# EAGLE design QuadPortIEC_v2 (EAGLE 7.7.0)
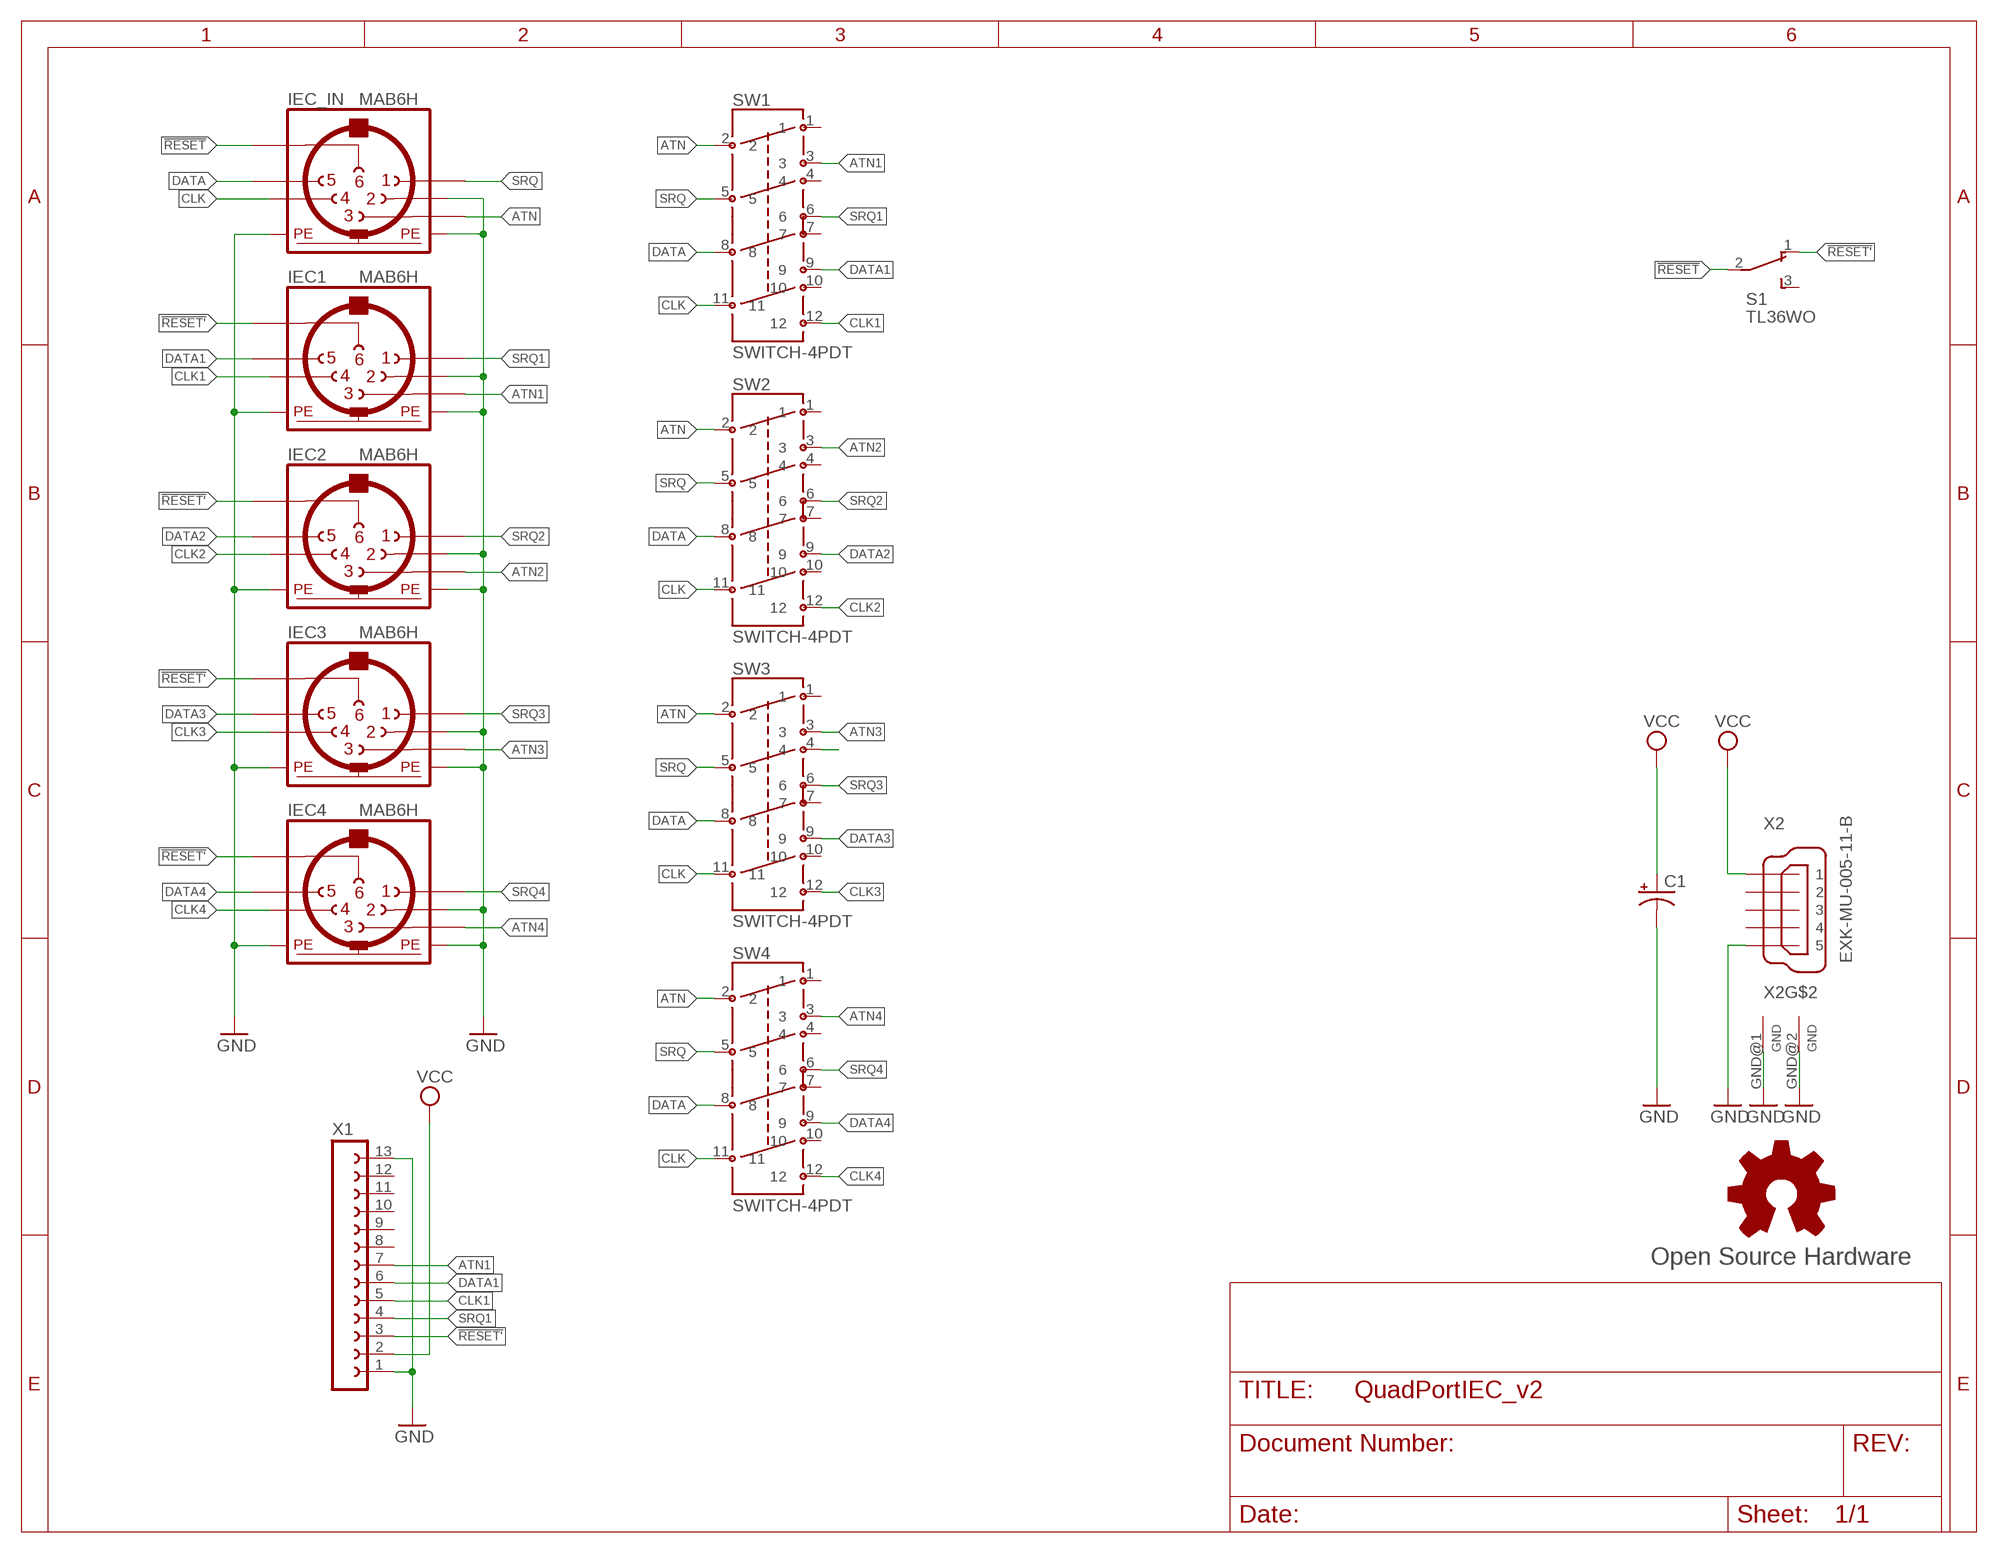
[diagram p0: schematic, sheet 1]

## Parts
C1  CPOL-USE5-8.5  [E5-8,5]
GOLD_ORB_SM1  Open Source Hardware  OSHWLOGOLOGO8MM  [OSHW_8MM]
IEC1  MAB6H  [MAB6H]
IEC2  MAB6H  [MAB6H]
IEC3  MAB6H  [MAB6H]
IEC4  MAB6H  [MAB6H]
IEC_IN  MAB6H  [MAB6H]
S1  TL36WO  [TL3XWO]
SW1  SWITCH-4PDT  [SWITCH-4PDT-ALPS]
SW2  SWITCH-4PDT  [SWITCH-4PDT-ALPS]
SW3  SWITCH-4PDT  [SWITCH-4PDT-ALPS]
SW4  SWITCH-4PDT  [SWITCH-4PDT-ALPS]
X1  FE13W  [FE13W]
X2  EXK-MU-005-11-B  [MINI-USB]

## Nets
!RESET: IEC_IN.6 S1.2(P)
!RESET': IEC1.6 IEC2.6 IEC3.6 IEC4.6 S1.1(O) X1.3
ATN: IEC_IN.3 SW1.2 SW2.2 SW3.2 SW4.2
ATN1: IEC1.3 SW1.3 X1.7
ATN2: IEC2.3 SW2.3
ATN3: IEC3.3 SW3.3
ATN4: IEC4.3 SW4.3
CLK: IEC_IN.4 SW1.11 SW2.11 SW3.11 SW4.11
CLK1: IEC1.4 SW1.12 X1.5
CLK2: IEC2.4 SW2.12
CLK3: IEC3.4 SW3.12
CLK4: IEC4.4 SW4.12
DATA: IEC_IN.5 SW1.8 SW2.8 SW3.8 SW4.8
DATA1: IEC1.5 SW1.9 X1.6
DATA2: IEC2.5 SW2.9
DATA3: IEC3.5 SW3.9
DATA4: IEC4.5 SW4.9
GND: C1.- IEC1.2 IEC1.PE IEC1.PE@(PE) IEC2.2 IEC2.PE IEC2.PE@(PE) IEC3.2 IEC3.PE IEC3.PE@(PE) IEC4.2 IEC4.PE IEC4.PE@(PE) IEC_IN.2 IEC_IN.PE IEC_IN.PE@(PE) X1.1 X1.13 X2.GND X2.GND@1(GND) X2.GND@2(GND)
N$32: SW3.4
SRQ: IEC_IN.1 SW1.5 SW2.5 SW3.5 SW4.5
SRQ1: IEC1.1 SW1.6 X1.4
SRQ2: IEC2.1 SW2.6
SRQ3: IEC3.1 SW3.6
SRQ4: IEC4.1 SW4.6
VCC: C1.+ X1.2 X2.VBUS
Unconnected: S1.3(S) SW1.1 SW1.4 SW1.7 SW1.10 SW2.1 SW2.4 SW2.7 SW2.10 SW3.1 SW3.7 SW3.10 SW4.1 SW4.4 SW4.7 SW4.10 X1.8 X1.9 X1.10 X1.11 X1.12 X2.D+ X2.D- X2.ID

## Library data of the parts
C1 = rcl:CPOL-US: POLARIZED CAPACITOR, American symbol
GOLD_ORB_SM1 = oshw:OSHWLOGO: The OSHW logo for PCB layout
IEC1-IEC4 IEC_IN = con-hirschmann:MAB6H: Female CONNECTOR 6 pins with shield, horizontal (DIN 45322)
S1 = switch:TL36WO: TINY SWITCH ON - ON Source: http://www2.produktinfo.conrad.com/datenblaetter/700000-724999/705152-da-01-de-Subminiaturschalter_TL_36WO.pdf
SW1-SW4 = switch-alps-jlb:SWITCH-4PDT: For use with a push-button switch made by ALPS components. The Part # is
X1 = con-lsta-rp:FE13W: FEMALE HEADER; OC_FARNELL: unknown; OC_NEWARK: unknown
X2 = con-usb-jlb:EXK-MU-005-11-B

## Board
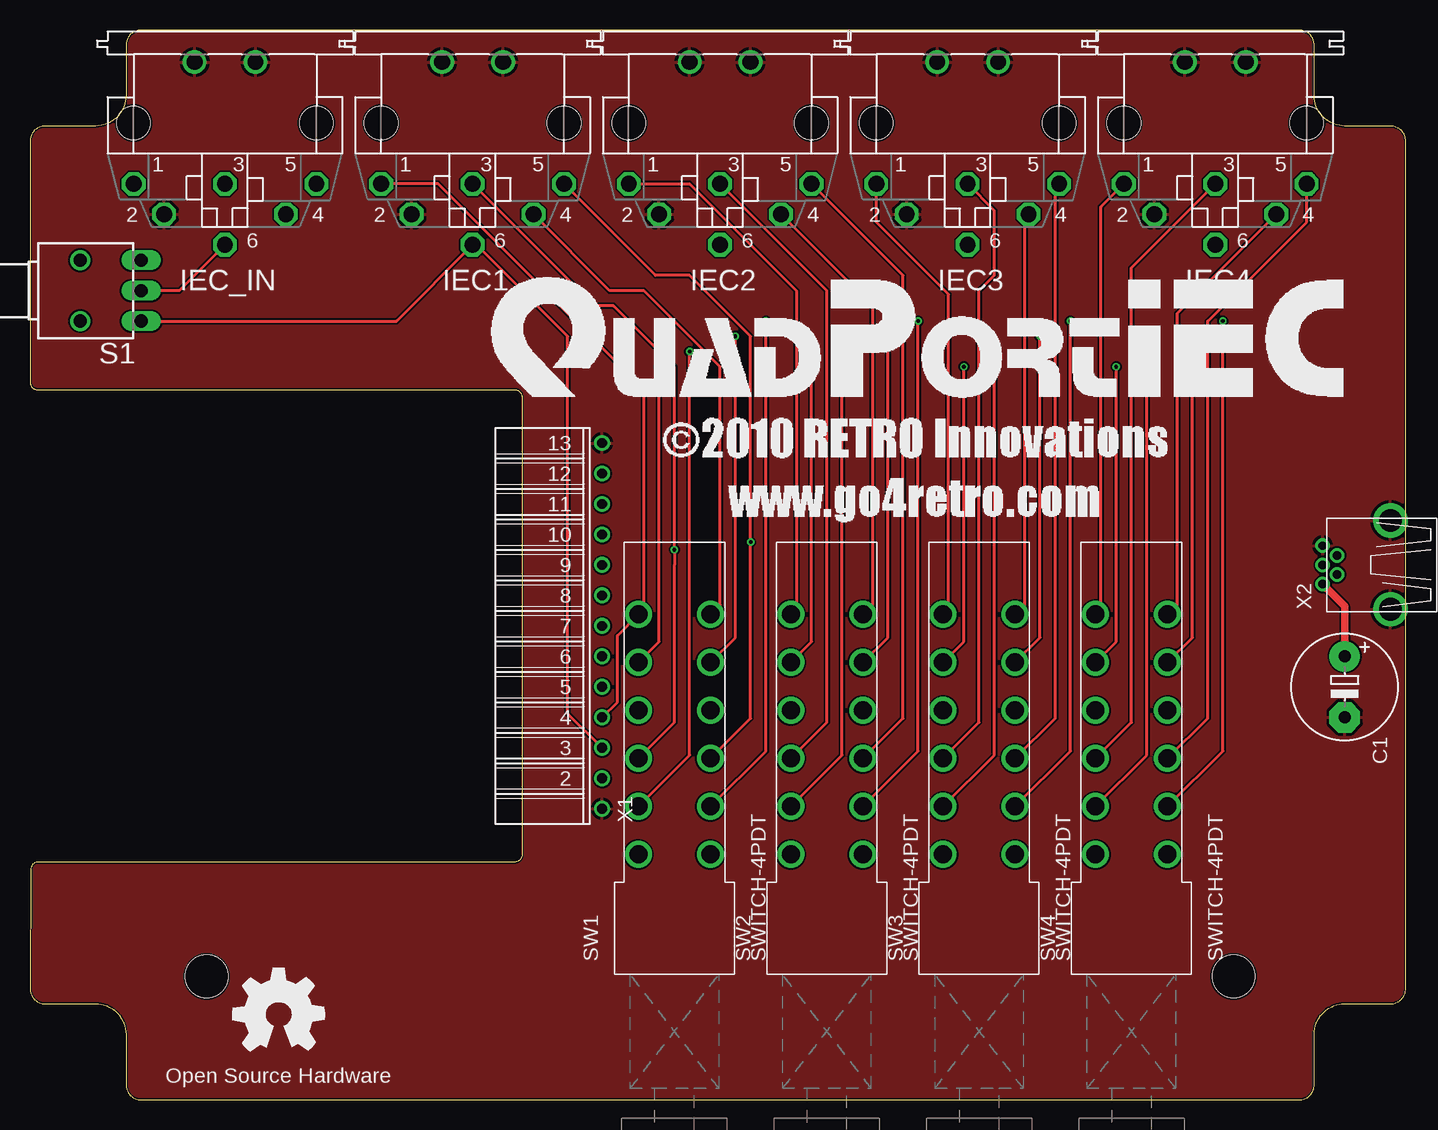
[diagram p1: board, top side]
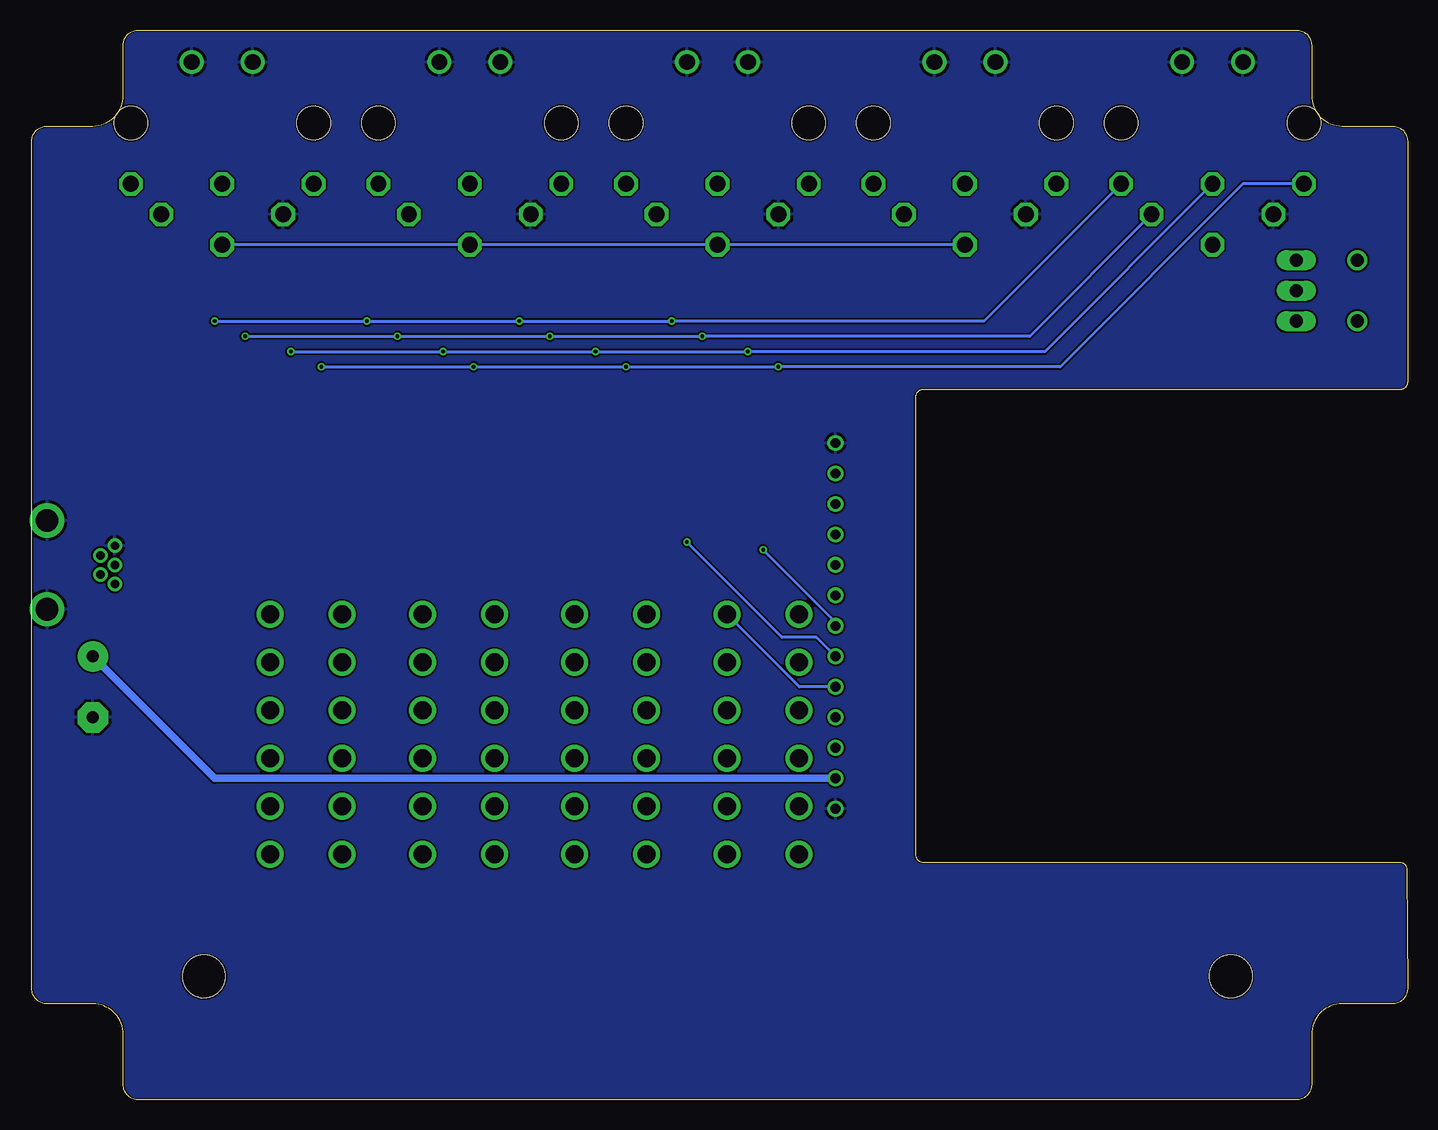
[diagram p2: board, bottom side, seen from below]

Size 114.68 x 89.15 mm. Coordinates in mm from the lower left corner, seen from the top.
Outline: 5.46,81.15 1.27,81.15 arc90 0,79.88 0,59.82 arc90 0.63,59.18 40.39,59.18 arc-90 41.02,58.55 41.02,20.45 arc-90 40.39,19.81 0.7,19.81 arc90 0.06,19.18 0,9.27 arc90 1.27,8 5.46,8 arc-90 8,5.46 8,1.27 arc90 9.27,0 105.79,0 arc90 107.06,1.27 107.06,5.46 arc-90 109.6,8 113.41,8 arc90 114.68,9.27 114.68,79.88 arc90 113.41,81.15 109.6,81.15 arc-90 107.06,83.69 107.06,87.88 arc90 105.79,89.15 9.27,89.15 arc90 8,87.88 8,83.69 arc-90 5.46,81.15
Copper layers (1*16): Top 0.035mm / dielectric 1.5mm / Bottom 0.035mm
Design rules "hackvana *": minimum track width 6mil, minimum drill 0.3mm, track to track 6mil, track to pad 6mil, pad to pad 6mil, via to via 6mil, smd to smd 0mil, copper to edge 6mil, drill to drill 6mil, minimum pad ring 10mil, minimum via ring 6mil, stop-mask expansion 2mil, vias tented up to drill 100mil, thermal gap 10mil
Holes 3.56 mm at 100.33,10.29 14.73,10.29

### Footprints (pad centres in the part's own frame; a part is rotated, then mirrored left to right if it is on the bottom)
E5-8,5 = drill 1.016 pad 2.54: + -2.54,0 | drill 1.016 pad 2.54 octagon: - 2.54,0
MAB6H = drill 1.321 octagon: 1 7.62,5.08; 2 5.08,7.62; 3 0,5.08; 4 -5.08,7.62; 5 -7.62,5.08; 6 0,10.16 | drill 1.321: PE -2.54,-5.08; PE@ 2.54,-5.08 | hole 2.794: 7.62,0; -7.62,0
TL3XWO = drill 1.1 pad 1.422 long: 1 -2.54,-5.08; 2 0,-5.08; 3 2.54,-5.08 | drill 1.1 pad 1.676: M1 -2.54,0; M2 2.54,0
SWITCH-4PDT-ALPS = drill 1.5: 1 0,3; 2 4,3; 3 8,3; 4 12,3; 5 16,3; 6 20,3; 7 0,-3; 8 4,-3; 9 8,-3; 10 12,-3; 11 16,-3; 12 20,-3
FE13W = drill 0.813: 1 -15.24,0; 2 -12.7,0; 3 -10.16,0; 4 -7.62,0; 5 -5.08,0; 6 -2.54,0; 7 0,0; 8 2.54,0; 9 5.08,0; 10 7.62,0; 11 10.16,0; 12 12.7,0; 13 15.24,0
MINI-USB = drill 0.7: D+ 4.381,0; D- 3.181,0.8; GND 4.381,-1.6; ID 3.181,-0.8; VBUS 4.381,1.6 | drill 1.9: GND@1 -1.269,3.7; GND@2 -1.269,-3.7

### Placement (x,y rotation side)
C1  109.6,34.42 270 top
GOLD_ORB_SM1  20.7,7.11 0 top
IEC1  36.89,81.41 180 top
IEC2  57.53,81.41 180 top
IEC3  78.17,81.41 180 top
IEC4  98.81,81.41 180 top
IEC_IN  16.26,81.41 180 top
S1  4.19,67.44 90 top
SW1  53.72,20.45 90 top
SW2  66.42,20.45 90 top
SW3  79.12,20.45 90 top
SW4  91.82,20.45 90 top
X1  47.69,39.5 90 top
X2  112.14,44.58 180 top

### Tracks (layer width: path | path; a pad name or v marks a point on that pad's centre or on a via)
!RESET
  Top 0.254: IEC_IN.6 12.45,67.44 S1.2
!RESET'
  Top 0.254: S1.1 30.54,64.9 IEC1.6 37.21,71.25 44.83,63.63 44.83,32.19 X1.3
  Bottom 0.254: IEC1.6 IEC2.6 IEC3.6 IEC4.6
ATN  (via drill 0.3)
  Top 0.254: SW1.2 54.99,28.72 v54.99,62.36 | SW2.2 67.69,28.72 v67.69,62.36 | SW3.2 80.39,28.72 v80.39,62.36 | SW4.2 93.09,28.72 v93.09,62.36
  Bottom 0.254: IEC_IN.3 30.23,62.36 v54.99,62.36 v67.69,62.36 v80.39,62.36 v93.09,62.36
ATN1  (via drill 0.3)
  Top 0.254: SW1.3 53.72,31.45 53.72,44.58 v53.72,45.85 53.72,61.09 48.64,66.17 47.05,66.17 IEC1.3
  Bottom 0.254: X1.7 47.69,39.81 v53.72,45.85
ATN2
  Top 0.254: SW2.3 66.42,31.45 66.42,67.44 IEC2.3
ATN3
  Top 0.254: SW3.3 79.12,31.45 79.12,67.44 80.39,68.71 80.39,74.1 IEC3.3
ATN4
  Top 0.254: SW4.3 91.82,31.45 91.82,69.34 IEC4.3
CLK  (via drill 0.3)
  Top 0.254: SW1.11 58.8,38.53 v58.8,63.63 | SW2.11 71.5,38.53 v71.5,63.63 | SW3.11 84.2,38.53 v84.2,63.63 | SW4.11 96.9,38.53 v96.9,63.63
  Bottom 0.254: IEC_IN.4 31.5,63.63 v58.8,63.63 v71.5,63.63 v84.2,63.63 v96.9,63.63
CLK1
  Top 0.254: IEC1.4 48.32,67.44 51.18,67.44 57.53,61.09 57.53,41.26 SW1.12
  Bottom 0.254: SW1.12 50.69,34.42 X1.5
CLK2
  Top 0.254: SW2.12 70.23,41.26 70.23,66.17 IEC2.4
CLK3
  Top 0.254: SW3.12 82.93,41.26 82.93,73.47 IEC3.4
CLK4
  Top 0.254: SW4.12 95.63,41.26 95.63,65.53 IEC4.4
DATA  (via drill 0.3)
  Top 0.254: SW1.8 61.34,29.07 v61.34,64.9 | SW2.8 74.04,29.07 v74.04,64.9 | SW3.8 86.74,29.07 v86.74,64.9 | SW4.8 99.44,29.07 v99.44,64.9
  Bottom 0.254: IEC_IN.5 35.31,64.9 v61.34,64.9 v74.04,64.9 v86.74,64.9 v99.44,64.9
DATA1  (via drill 0.3)
  Top 0.254: SW1.9 60.07,31.8 v60.07,46.48 60.07,63.63 54.99,68.71 52.13,68.71 IEC1.5
  Bottom 0.254: X1.6 49.28,38.55 52.13,38.55 v60.07,46.48
DATA2
  Top 0.254: SW2.9 72.77,31.8 72.77,68.71 IEC2.5
DATA3
  Top 0.254: SW3.9 85.47,31.8 85.47,76.01 IEC3.5
DATA4
  Top 0.254: SW4.9 98.17,31.8 98.17,64.9 106.43,73.15 IEC4.5
GND
  pour Top: 105.79,0 9.27,0 arc-90 8,1.27 8,5.46 arc90 5.46,8 1.27,8 arc-90 0,9.27 0.06,19.18 arc-90 0.69,19.81 40.39,19.81 arc90 41.02,20.45 41.02,58.55 arc90 40.39,59.18 0.63,59.18 arc-90 0,59.82 0,79.88 arc-90 1.27,81.15 5.46,81.15 arc90 8,83.69 8,87.88 arc-90 9.27,89.15 105.79,89.15 arc-90 107.06,87.88 107.06,83.69 arc90 109.6,81.15 113.41,81.15 arc-90 114.68,79.88 114.68,9.27 arc-90 113.41,8 109.6,8 arc90 107.06,5.46 107.06,1.27 arc-90
  pour Bottom: 105.79,0 9.27,0 arc-90 8,1.27 8,5.46 arc90 5.46,8 1.27,8 arc-90 0,9.27 0.06,19.18 arc-90 0.69,19.81 40.39,19.81 arc90 41.02,20.45 41.02,58.55 arc90 40.39,59.18 0.63,59.18 arc-90 0,59.82 0,79.88 arc-90 1.27,81.15 5.46,81.15 arc90 8,83.69 8,87.88 arc-90 9.27,89.15 105.79,89.15 arc-90 107.06,87.88 107.06,83.69 arc90 109.6,81.15 113.41,81.15 arc-90 114.68,79.88 114.68,9.27 arc-90 113.41,8 109.6,8 arc90 107.06,5.46 107.06,1.27 arc-90
SRQ  (via drill 0.3)
  Top 0.254: SW1.5 52.45,38.18 v52.45,61.09 | SW2.5 65.15,38.18 v65.15,61.09 | SW3.5 77.85,38.18 v77.85,61.09 | SW4.5 90.55,38.18 v90.55,61.09
  Bottom 0.254: IEC_IN.1 13.72,76.33 28.96,61.09 v52.45,61.09 v65.15,61.09 v77.85,61.09 v90.55,61.09
SRQ1
  Top 0.254: IEC1.1 34.04,76.33 51.18,59.18 51.18,40.77 50.86,40.45 SW1.6 48.96,38.68 48.96,33.15 X1.4
SRQ2
  Top 0.254: SW2.6 63.88,40.91 63.88,67.44 54.99,76.33 IEC2.1
SRQ3
  Top 0.254: SW3.6 76.58,40.91 76.58,67.12 70.55,73.15 IEC3.1
SRQ4
  Top 0.254: SW4.6 89.28,40.91 89.28,74.42 IEC4.1
VCC
  Top 0.61: X2.VBUS 109.6,41.14 C1.+
  Bottom 0.61: X1.2 99.44,26.8 C1.+

### Text on the board
Reference: 1591XXGTBU